# Altium project Conveyer_ControlBoard.PrjPcb
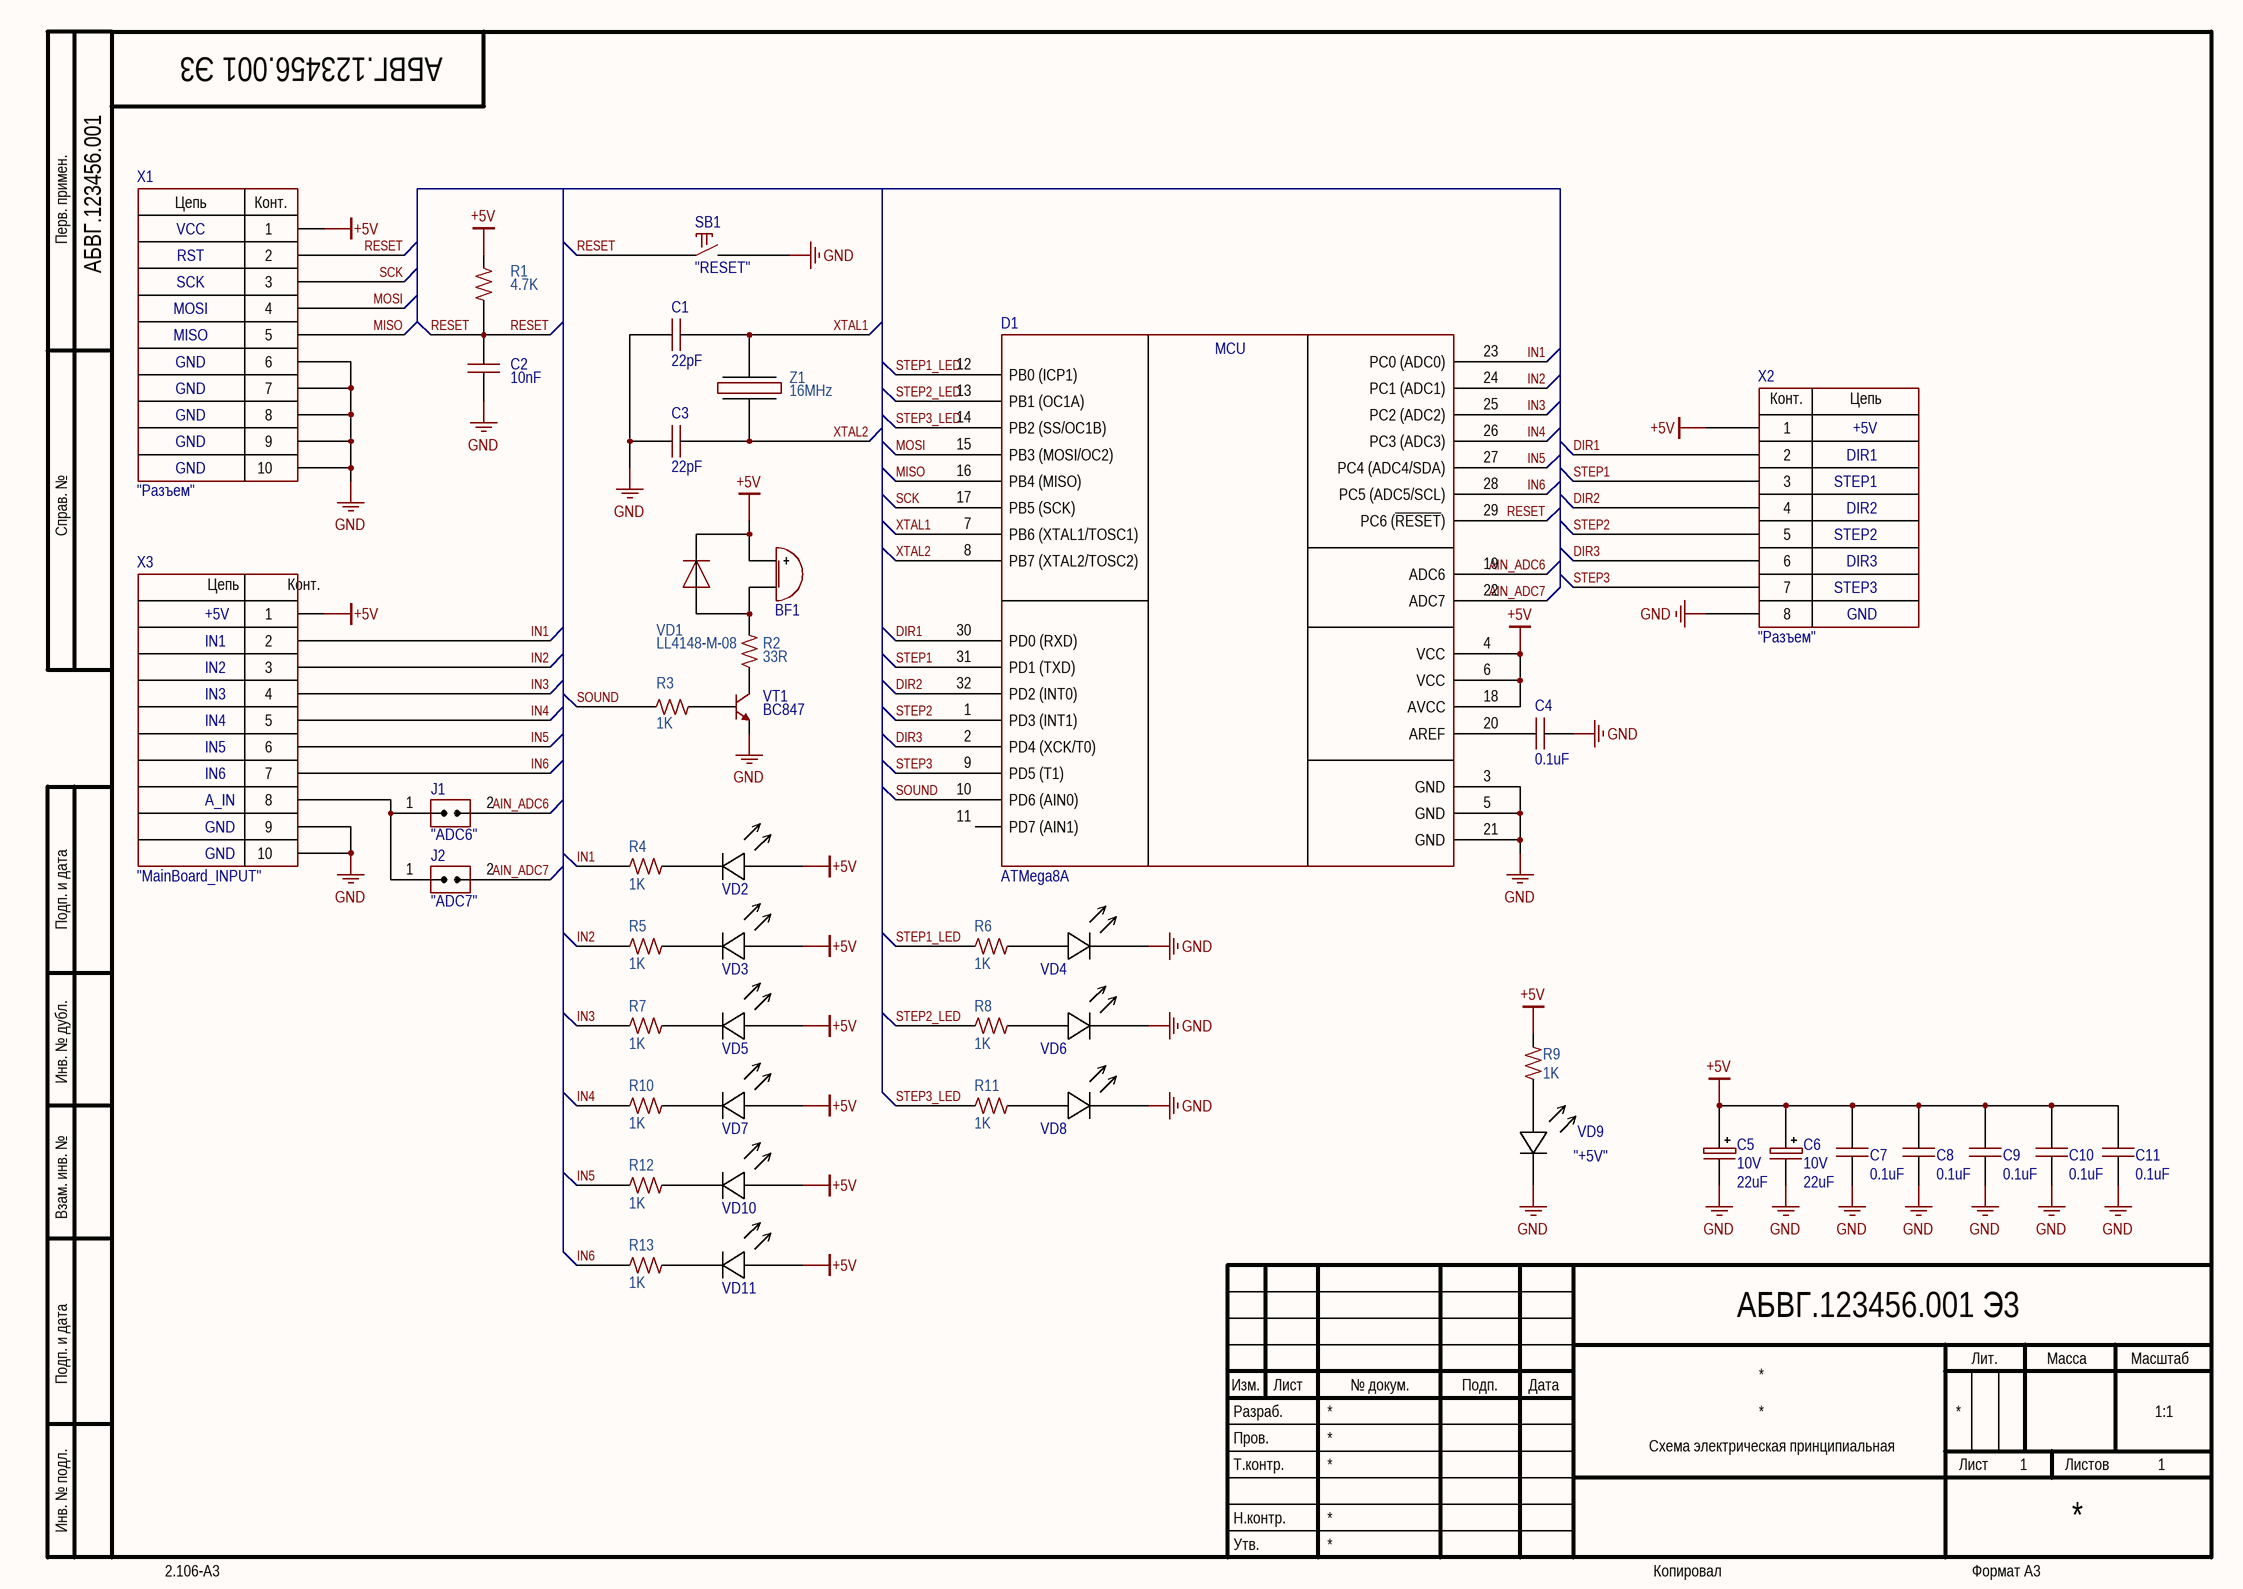
[diagram p0: Sheet_1.SchDoc]
1 sheet, 45 parts. Net scope: global (net labels, ports and power ports of the same name join across sheets).
Board file: PCB.PcbDoc

## Sheet Sheet_1.SchDoc
size 420 x 297 mm; Address1: Address1; Address2: Address2; Address3: Address3; Address4: Address4; DocumentNumber: АБВГ.123456.001 Э3; SheetNumber: 1; SheetTotal: 1; Scale: 1:1; DocumentType: Схема электрическая принципиальная; FirstReferrence: АБВГ.123456.001

### Parts
BF1  (no value)  [BUZ: AI-1223-TWT-3V-2-R]
C1  Значение: 22pF  [CAP: 0805]  (hidden comment: Керамический SMD)
C2  Значение: 10nF  [CAP: 0805]  (hidden comment: Керамический SMD)
C3  Значение: 22pF  [CAP: 0805]  (hidden comment: Керамический SMD)
C4  Значение: 0.1uF  [CAP: 0805]  (hidden comment: Керамический SMD)
C5  Напряжение: 10V  Значение: 22uF  [CAP: TANTAL-B]
C6  Напряжение: 10V  Значение: 22uF  [CAP: TANTAL-B]
C7  Значение: 0.1uF  [CAP: 0805]  (hidden comment: Керамический SMD)
C8  Значение: 0.1uF  [CAP: 0805]  (hidden comment: Керамический SMD)
C9  Значение: 0.1uF  [CAP: 0805]  (hidden comment: Керамический SMD)
C10  Значение: 0.1uF  [CAP: 0805]  (hidden comment: Керамический SMD)
C11  Значение: 0.1uF  [CAP: 0805]  (hidden comment: Керамический SMD)
D1  ATMega8A  [32-LQFP]
J1  CommentText: "ADC6"  [CON: JUMPER x1]
J2  CommentText: "ADC7"  [CON: JUMPER x1]
R1  value 4.7K  [RES: 0805]
R2  value 33R  [RES: 0805]
R3  value 1K  [RES: 0805]
R4  value 1K  [RES: 0805]
R5  value 1K  [RES: 0805]
R6  value 1K  [RES: 0805]
R7  value 1K  [RES: 0805]
R8  value 1K  [RES: 0805]
R9  value 1K  [RES: 0805]
R10  value 1K  [RES: 0805]
R11  value 1K  [RES: 0805]
R12  value 1K  [RES: 0805]
R13  value 1K  [RES: 0805]
SB1  CommentText: "RESET"  [BUT: 6x6 SMD]
VD1  PartNumber: LL4148-M-08  [DIODE: SOD80]
VD2  (no value)  [LED: 3mmG]
VD3  (no value)  [LED: 3mmG]
VD4  (no value)  [LED: 3mmG]
VD5  (no value)  [LED: 3mmG]
VD6  (no value)  [LED: 3mmG]
VD7  (no value)  [LED: 3mmG]
VD8  (no value)  [LED: 3mmG]
VD9  "+5V"  [LED: 3mmB]
VD10  (no value)  [LED: 3mmG]
VD11  (no value)  [LED: 3mmG]
VT1  PartNumber: BC847  [SOT23]
X1  CommentText: "Разъем"  [CON: PROG(PCB) ISP]
X2  CommentText: "Разъем"  [CON: PLS-8]
X3  CommentText: "MainBoard_INPUT"  [CON: PLS-10]
Z1  Frequency: 16MHz  [OSC: 5032_ABM3]

### Nets
+5V: BF1.1(+) C5.1 C6.1 C7.2 C8.2 C9.2 C10.2 C11.2 D1.4(VCC) D1.6(VCC) D1.18(AVCC) R1.1 R9.2 VD1.2 VD2.1(A) VD3.1(A) VD5.1(A) VD7.1(A) VD10.1(A) VD11.1(A) X1.1 X2.1 X3.1
GND: C1.2 C2.2 C3.2 C4.2 C5.2 C6.2 C7.1 C8.1 C9.1 C10.1 C11.1 D1.3(GND) D1.5(GND) D1.21(GND) SB1.2 VD4.2(C) VD6.2(C) VD8.2(C) VD9.2(C) VT1.3(E) X1.6 X1.7 X1.8 X1.9 X1.10 X2.8 X3.9 X3.10
AIN_ADC6: D1.19(ADC6) J1.2(IN)
AIN_ADC7: D1.22(ADC7) J2.2(IN)
DIR1: D1.30(PD0_(RXD)) X2.2
DIR2: D1.32(PD2_(INT0)) X2.4
DIR3: D1.2(PD4_(XCK/T0)) X2.6
IN1: D1.23(PC0_(ADC0)) R4.1 X3.2
IN2: D1.24(PC1_(ADC1)) R5.1 X3.3
IN3: D1.25(PC2_(ADC2)) R7.1 X3.4
IN4: D1.26(PC3_(ADC3)) R10.1 X3.5
IN5: D1.27(PC4_(ADC4/SDA)) R12.1 X3.6
IN6: D1.28(PC5_(ADC5/SCL)) R13.1 X3.7
MISO: D1.16(PB4_(MISO)) X1.5
MOSI: D1.15(PB3_(MOSI/OC2)) X1.4
RESET: C2.1 D1.29(PC6_(~{RESET})) R1.2 SB1.1 X1.2
SCK: D1.17(PB5_(SCK)) X1.3
SOUND: D1.10(PD6_(AIN0)) R3.2
STEP1: D1.31(PD1_(TXD)) X2.3
STEP1_LED: D1.12(PB0_(ICP1)) R6.1
STEP2: D1.1(PD3_(INT1)) X2.5
STEP2_LED: D1.13(PB1_(OC1A)) R8.1
STEP3: D1.9(PD5_(T1)) X2.7
STEP3_LED: D1.14(PB2_(SS/OC1B)) R11.1
XTAL1: C1.1 D1.7(PB6_(XTAL1/TOSC1)) Z1.2
XTAL2: C3.1 D1.8(PB7_(XTAL2/TOSC2)) Z1.1
NetBF1_2: BF1.2(-) R2.1 VD1.1
NetC4_1: C4.1 D1.20(AREF)
NetJ1_1: J1.1(IN) J2.1(IN) X3.8
NetR2_2: R2.2 VT1.2(C)
NetR3_1: R3.1 VT1.1(B)
NetR4_2: R4.2 VD2.2(C)
NetR5_2: R5.2 VD3.2(C)
NetR6_2: R6.2 VD4.1(A)
NetR7_2: R7.2 VD5.2(C)
NetR8_2: R8.2 VD6.1(A)
NetR9_1: R9.1 VD9.1(A)
NetR10_2: R10.2 VD7.2(C)
NetR11_2: R11.2 VD8.1(A)
NetR12_2: R12.2 VD10.2(C)
NetR13_2: R13.2 VD11.2(C)

Not connected (* = marked no-connect by the designer): D1 11(PD7_(AIN1))

### Notes on the sheet
- +5V
- DIR1
- STEP1
- DIR2
- STEP2
- DIR3
- STEP3
- IN1
- IN2
- GND
- IN3
- IN4
- IN5
- IN6
- A_IN
- Перв. примен.
- Справ. №
- Подп. и дата
- Инв. № дубл.
- Взам. инв. №
- Разраб.
- Изм.
- Лист
- № докум.
- Подп.
- Дата
- Лит.
- Масса
- Масштаб
- Пров.
- Т.контр.
- Листов
- Инв. № подл.
- Утв.
- Н.контр.
- 2.106-A3
- Копировал
- Формат А3
- (in symbol ATmega8) MCU
- (in symbol Connector_ISP_PCB) Цепь; Конт.; VCC; RST; SCK; MOSI; MISO; GND
- (in symbol PLS-8) Конт.; Цепь
- (in symbol PLS-10) Цепь; Конт.

### Library data of the parts
BF1 = Buzzer: Manufacturer: PUI Audio; ValueManufacturerPartNumber: DIP switch, 2.73 kHz, 3VDC, 80mA, -20...+70°C; PartNumber: AT-0927-TT-6-R; TypeBuzzer: DIP switch; VoltageMax: 3VDC; Frequency: 2.73 kHz; CurrentMax: 80mA; HelpURL: https://www.digikey.com/products/en?keywords=AT-0927-TT-6-R; Temperature: -20...+70°C
C1-C4 C7-C11 = Керамический SMD: Производитель: Yageo; УникальныйНомер: CC0201KRX7R7BB103; Типоразмер: 0201; Ссылка: ***; ТипКомпонента: Ceramic capacitor; Точность: ±10%; ТипДиэлектрика: X7R; Напряжение: 16V
C5 C6 = Танталы SMD: Производитель: AVX; УникальныйНомер: F930J107KAAAJ6; Типоразмер: Тип А (3216); Ссылка: ***; Точность: ±10%; ТипКомпонента: Tantalum capacitor
D1 = ATmega8: Корпус TQFP-44, Ядро AVR, Максимальная частота ядра 20 МГц, Объём памяти программ 65.54 кБайт, Объём EEPROM памяти 2.05 кБайт, Объём оперативной памяти 4.1 кБайт, Интерфейсы I²C, SPI, UART/USART, Периферия Brown-out Detect/Reset, POR, PWM, WDT, АЦП/ЦАП A/D 8x10b, Напряжение питания, min 2.7 В, Напряжение питания, max 5.5 В
J1 J2 = Jumper_2_pin
R1 = Resistor_0805_ieee: Manufacturer: Vishay Intertech; PartNumber: CRCW080533R0FKEA; ValueManufacturerPartNumber: Резистор SMD, 4.7K, ±1%, 0805, 0.125W, -55...+125°C; TypeResistor: Резистор SMD; Power: 0.125W; Tolerance: ±1%; Package: 0805; HelpURL: https://www.digikey.com/product-detail/en/yageo/RC0805JR-07100RL/311-100ARCT-ND/731185; Temperature: -55...+125°C
R2 = Resistor_0805_ieee: Manufacturer: Vishay Intertech; PartNumber: CRCW080533R0FKEA; ValueManufacturerPartNumber: Резистор SMD, 33R, ±1%, 0805, 0.125W, -55...+125°C; TypeResistor: Резистор SMD; Power: 0.125W; Tolerance: ±1%; Package: 0805; HelpURL: https://www.digikey.com/product-detail/en/yageo/RC0805JR-07100RL/311-100ARCT-ND/731185; Temperature: -55...+125°C
R3 = Resistor_0805_ieee: Manufacturer: Vishay Intertech; PartNumber: CRCW08051K00JNEA; ValueManufacturerPartNumber: Резистор SMD, 1K, ±1%, 0805, 0.125W, -55...+125°C; TypeResistor: Резистор SMD; Power: 0.125W; Tolerance: ±1%; Package: 0805; HelpURL: https://www.digikey.com/product-detail/en/yageo/RC0805JR-07100RL/311-100ARCT-ND/731185; Temperature: -55...+125°C
R4-R13 = Resistor_0805_ieee: Manufacturer: Vishay Intertech; PartNumber: CRCW080533R0FKEA; ValueManufacturerPartNumber: Резистор SMD, 1K, ±1%, 0805, 0.125W, -55...+125°C; TypeResistor: Резистор SMD; Power: 0.125W; Tolerance: ±1%; Package: 0805; HelpURL: https://www.digikey.com/product-detail/en/yageo/RC0805JR-07100RL/311-100ARCT-ND/731185; Temperature: -55...+125°C
SB1 = Button_tactile: Manufacturer: TE Connectivity; ValueManufacturerPartNumber: Tactile button, 6x6mm; PartNumber: FSM2JSMAATR; TypeButton: Tactile button; HelpURL: https://www.digikey.com/product-detail/en/te-connectivity-alcoswitch-switches/FSM2JSMAATR/450-1792-1-ND/3503931; Package: 6x6mm
VD1 = Diode_single: Manufacturer: Vishay Intertech; ValueManufacturerPartNumber: Single diode, 75V, 150mA, 1V, 4ns, SOD-80, -55...+150°C; TypeDiode: Single diode; Voltage: 75V; Current: 150mA; VoltageDrop: 1V; RecoveryTime: 4ns; Package: SOD-80; HelpURL: https://www.digikey.com/product-detail/en/micro-commercial-co/1N4148WX-TP/1N4148WXTPMSCT-ND/717312; Temperature: -55...+150°C
VD2-VD11 = LED_single: ValueManufacturerPartNumber: LED, Green, *, *, *, -55...+150°C; TypeDiode: LED; ColorParameter: Green; Manufacturer: *; Package: *; HelpURL: *; Temperature: -55...+150°C; Current: *; VoltageDrop: *; PartNumber: *; Color: GREEN
VT1 = BJT_NPN_123: Manufacturer: ON Semiconductor; ValueManufacturerPartNumber: NPN transistor, 45V, 100mA, 100MHz, 300mW, 0.6V, 420, SOT-23, -55...+125°C; TypeTransistor: NPN transistor; VoltageCE: 45V; CurrentCE: 100mA; VoltageSaturation: 0.6V; Frequency: 100MHz; CurrentGain: 420; MaxPower: 300mW; Package: SOT-23; HelpURL: https://www.digikey.com/product-detail/en/on-semiconductor/BC847CLT1G/BC847CLT1GOSCT-ND/917836; Temperature: -55...+125°C
X1 = Connector_ISP_PCB: Manufacturer: Connfly; ValueManufacturerPartNumber: Connector, 6pin, 2.54mm, 250VAC, 3A; PartNumber: IDC-6; VoltageMax: 250VAC; Pitch: 2.54mm; CurrentMax: 3A; Multichannel: 6pin; HelpURL: https://ru.aliexpress.com/item/1719644716.html?spm=a2g0v.search0104.3.23.4d9c1bc6xlIt6Q&ws_ab_test=searchweb0_0%2Csearchweb201602_10_10065_10068_319_317_10696_453_10084_454_10083_10618_10307_10301_537_536_10059_10884_10887_321_322_10915_10103_10914_10911_10910%2Csearchweb201603_52%2CppcSwitch_0&algo_expid=18a75006-9775-490c-9b34-8e5eba9edd8d-3&algo_pvid=18a75006-9775-490c-9b34-8e5eba9edd8d&transAbTest=ae803_5; TypeConnector: Connector
X2 = PLS-8: Manufacturer: Connfly; ValueManufacturerPartNumber: Connector, 8pin, 2.54mm, 500VAC, 3A; TypeConnector: Connector; VoltageMax: 500VAC; Pitch: 2.54mm; CurrentMax: 3A; Multichannel: 8pin; HelpURL: https://www.chipdip.ru/product/pls-8-ds1021-1-8sf112; PartNumber: PLS-8
X3 = PLS-10: Manufacturer: Connfly; ValueManufacturerPartNumber: Connector, 10pin, 2.54mm, 500VAC, 3A; TypeConnector: Connector; VoltageMax: 500VAC; Pitch: 2.54mm; CurrentMax: 3A; Multichannel: 10pin; HelpURL: https://www.chipdip.ru/product/pls-10; PartNumber: PLS-10
Z1 = Crystal_5032_ABM3: Manufacturer: ABRACON LLC; PartNumber: ABM3-16.000MHZ-D2Y-T; ValueManufacturerPartNumber: Crystal, 16MHz, 18pF, ±20ppm, ABM3, -40...+85°C; LoadCapacitance: 18pF; Tolerance: ±20ppm; Package: ABM3; HelpURL: https://www.digikey.com/product-detail/en/epson/FC-135-32.7680KA-A5/SER4103CT-ND/6188447; Temperature: -40...+85°C; TypeOscilator: Crystal